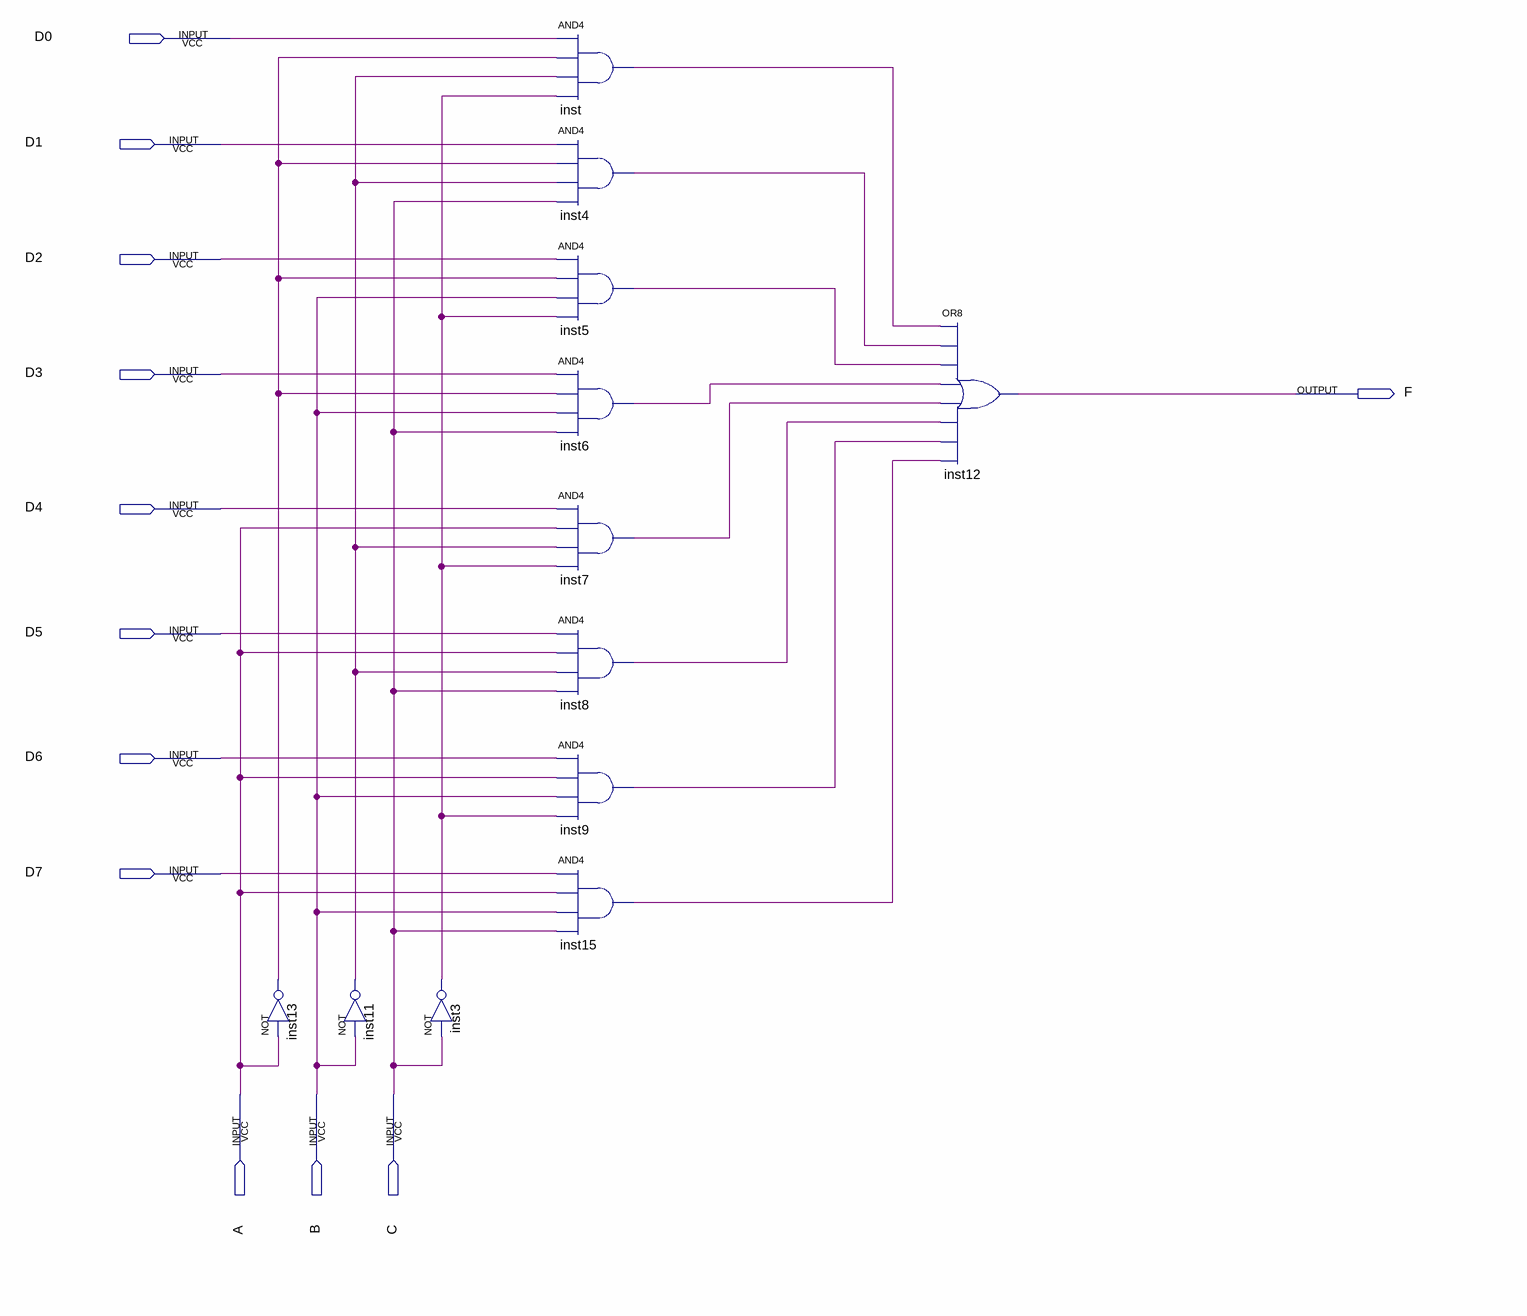
[diagram p0: schematic sheet]
// Quartus schematic CPLD_Mux_8to1.bdf as structural Verilog: 12 symbols, 12 pins
module CPLD_Mux_8to1 (
  input  D0,
  input  D1,
  input  D2,
  input  D3,
  input  D4,
  input  D5,
  input  D6,
  input  D7,
  input  A,
  input  B,
  input  C,
  output F
);

  wire inst3_out, inst4_out, inst5_out, inst6_out, inst7_out, inst8_out, inst9_out, inst11_out, inst13_out,
       inst15_out, inst_out;

  not inst13 (inst13_out, A);
  not inst11 (inst11_out, B);
  not inst3 (inst3_out, C);
  and inst (inst_out, D0, inst13_out, inst11_out, inst3_out);
  and inst4 (inst4_out, D1, inst13_out, inst11_out, C);
  and inst5 (inst5_out, D2, inst13_out, B, inst3_out);
  and inst6 (inst6_out, D3, inst13_out, B, C);
  and inst7 (inst7_out, D4, A, inst11_out, inst3_out);
  and inst8 (inst8_out, D5, A, inst11_out, C);
  and inst9 (inst9_out, D6, A, B, inst3_out);
  and inst15 (inst15_out, D7, A, B, C);
  or inst12 (F, inst_out, inst4_out, inst5_out, inst6_out, inst7_out, inst8_out, inst9_out, inst15_out);
endmodule
